# EasyEDA schematic SCH_PAYLOAD_2022-04-15.json
TITLE: Payload PCB; REV: 1.0; Date: 13-04-2022; Sheet: 1/1; Drawn By: Nipun Gupta; Company: Garuda
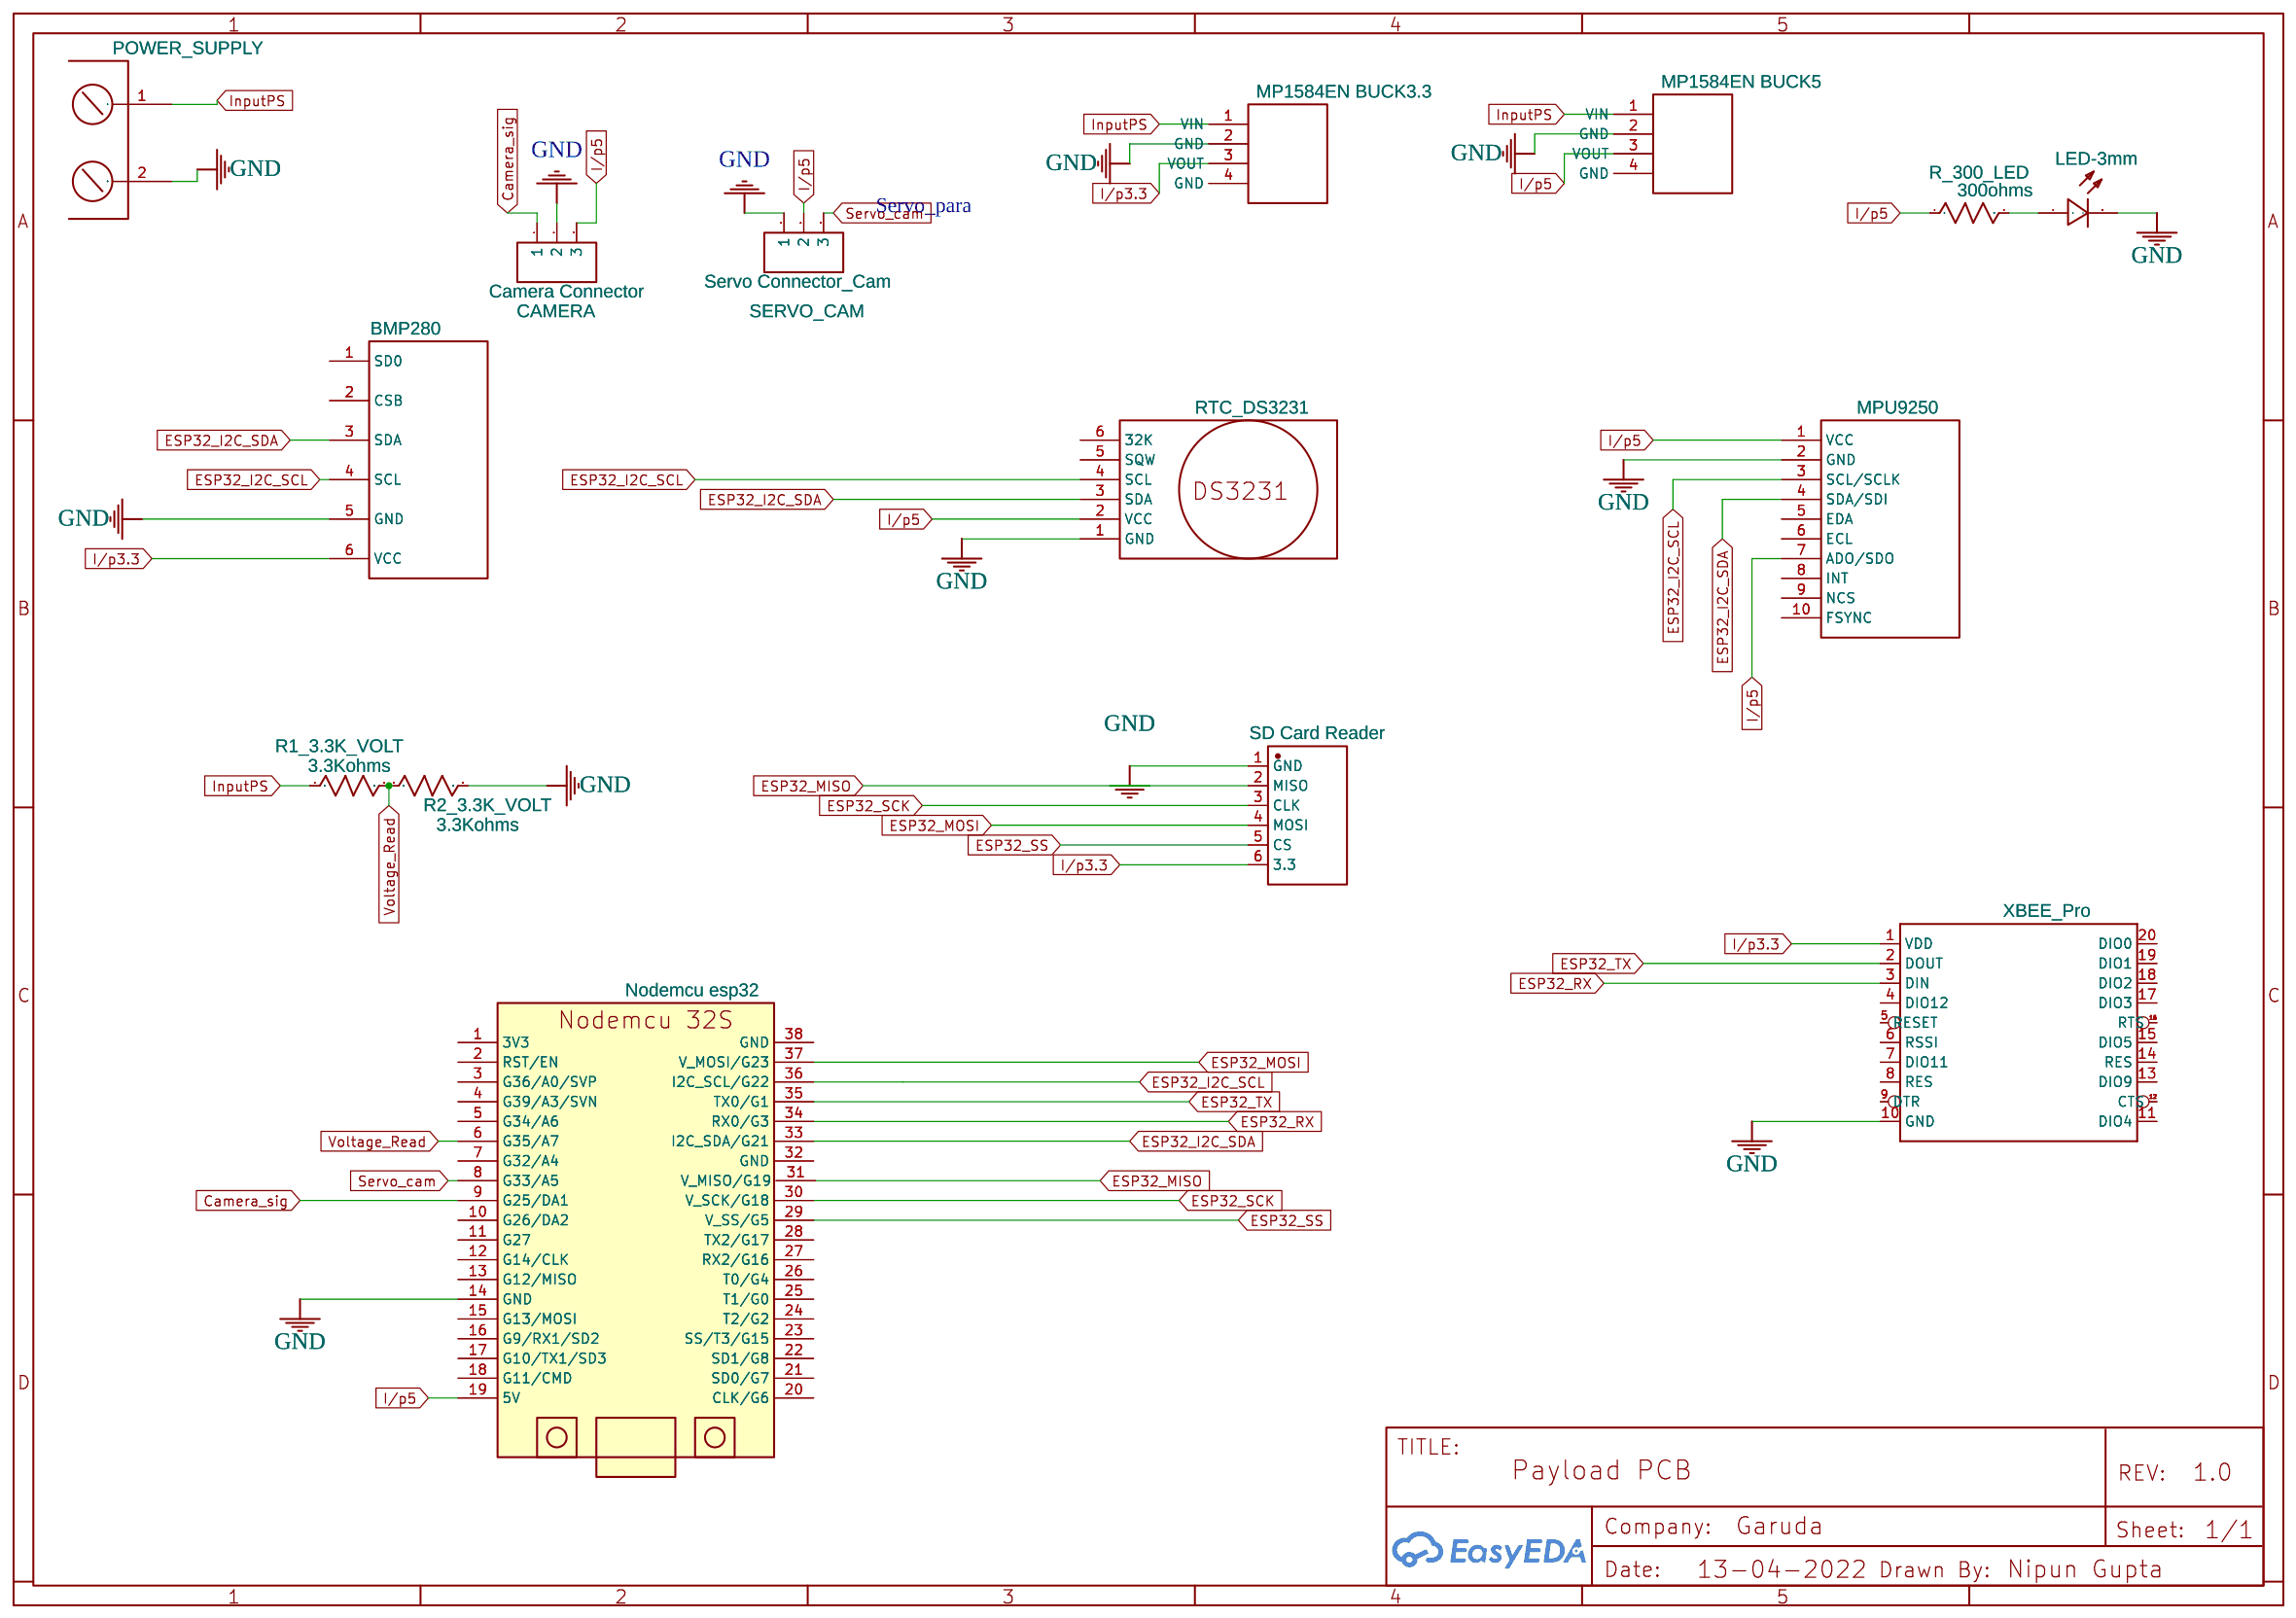
[diagram p0: schematic sheet]

## Parts
CAMERA  Camera Connector  [HDR-TH_3P-P2.54-V-F]
J1  POWER_SUPPLY  [5A_2PIN-TERMINALBLOCK]
JP2  XBEE_Pro  [XBEE-PRO-]
LED1  LED-3mm  [LED-3MM/2.54]
PRESS1  BMP280  [BMP 280 FOOT]
R1_3.3K_VOLT  3.3Kohms  [AXIAL-0.3]
R2_3.3K_VOLT  3.3Kohms  [AXIAL-0.3]
R_300_LED  300ohms  [AXIAL-0.3]
S1  MPU9250  [MPU9250_NOHOLE]
SD-READER3  SD Card Reader  [SD CARD READER FOOT]
SERVO_CAM  Servo Connector_Cam  [HDR-TH_3P-P2.54-V-F]
U2  MP1584EN BUCK5  [MP1584EN]
U3  MP1584EN BUCK3.3  [MP1584EN]
U9  RTC_DS3231  [DS3231]
U11  Nodemcu esp32  [NODEMCU-ESP32S]

## Library data of the parts
CAMERA SERVO_CAM = Header-Female-2.54_1x3: Supplier Part: C146243; Supplier: LCSC; Manufacturer: Boom Precision Elec; link: https://datasheet.lcsc.com/szlcsc/Boom-Precision-Elec-2-54mm-1-8P-Straight-Female-header_C27438.pdf; JLCPCB Part Class: Extended Part
J1 = 2pin_5A_TerminalBlock: Contributor: Obeng_smd
JP2 = XBEE_Pro: Digi XBee and XBee Pro; Contributor: Dev 91
LED1 = -: Supplier: LCSC; Manufacturer: EVERLIGHT; Manufacturer Part: 204-10SURD/S530-A3; Supplier Part: C99772
PRESS1 = BMP280 Sparkfun: Contributor: NIPUN GUPTA; sourceId: 6GASa4mDV; Manufacturer Part: ?
R1_3.3K_VOLT R2_3.3K_VOLT R_300_LED = Res_AXIAL-0.3(1/8W)_US: Manufacturer Part: ?; Package Display: No
S1 = MPU9250-MDL NO HOLES: TaoBao: GY-9250; Contributor: abyssvulcan; Supplier Part: GY-9250; Supplier: TaoBao
SD-READER3 = Micro SD Card Reader: Manufacturer Part: SD card reader 17.9x17.9; Contributor: Tinerfe; Supplier: AliExpress; Manufacturer: ShengYang; link: https://www.aliexpress.com/item/32867572635.html
U2 U3 = MP1584EN COPY: Contributor: babeinlovexd
U9 = UhrModul_DS3231: Contributor: Muffel
U11 = Nodemcu esp32: Contributor: SSanya

## Nets
GND: CAMERA.2 J1.2 JP2.10(GND) LED1.2(-) PRESS1.5(GND) R2_3.3K_VOLT.2 S1.2(GND) SD-READER3.1(GND) SERVO_CAM.1 U2.2(GND) U3.2(GND) U9.1(GND) U11.14(GND)
Camera_sig: CAMERA.1 U11.9(G25/DA1)
ESP32_I2C_SCL: PRESS1.4(SCL) S1.3(SCL/SCLK) U9.4(SCL) U11.36(I2C SCL/G22)
ESP32_I2C_SDA: PRESS1.3(SDA) S1.4(SDA/SDI) U9.3(SDA) U11.33(I2C SDA/G21)
ESP32_MISO: SD-READER3.2(MISO) U11.31(V_MISO/G19)
ESP32_MOSI: SD-READER3.4(MOSI) U11.37(V_MOSI/G23)
ESP32_RX: JP2.3(DIN) U11.34(RX0/G3)
ESP32_SCK: SD-READER3.3(CLK) U11.30(V_SCK/G18)
ESP32_SS: SD-READER3.5(CS) U11.29(V_SS/G5)
ESP32_TX: JP2.2(DOUT) U11.35(TX0/G1)
I/p3.3: JP2.1(VDD) PRESS1.6(VCC) SD-READER3.6(3.3) U3.3(VOUT)
I/p5: CAMERA.3 R_300_LED.1 S1.1(VCC) S1.7(ADO/SDO) SERVO_CAM.2 U2.3(VOUT) U9.2(VCC) U11.19(5V)
InputPS: J1.1 R1_3.3K_VOLT.1 U2.1(VIN) U3.1(VIN)
Servo_cam: SERVO_CAM.3 U11.8(G33/A5)
Voltage_Read: R1_3.3K_VOLT.2 R2_3.3K_VOLT.1 U11.6(G35/A7)
Net-(LED1-1): LED1.1(+) R_300_LED.2

Not connected (* = marked no-connect by the designer): JP2 4(DIO12) 5(RESET) 6(RSSI) 7(DIO11) 8(RES) 9(DTR) 11(DIO4) 12(CTS) 13(DIO9) 14(RES) 15(DIO5) 16(RTS) 17(DIO3) 18(DIO2) 19(DIO1) 20(DIO0); PRESS1 1(SD0) 2(CSB); S1 5(EDA) 6(ECL) 8(INT) 9(NCS) 10(FSYNC); U2 4(GND); U3 4(GND); U9 5(SQW) 6(32K); U11 1(3V3) 2(RST/EN) 3(G36/A0/SVP) 4(G39/A3/SVN) 5(G34/A6) 7(G32/A4) 10(G26/DA2) 11(G27) 12(G14/CLK) 13(G12/MISO) 15(G13/MOSI) 16(G9/RX1/SD2) 17(G10/TX1/SD3) 18(G11/CMD) 20(CLK/G6) 21(SD0/G7) 22(SD1/G8) 23(SS/T3/G15) 24(T2/G2) 25(T1/G0) 26(T0/G4) 27(RX2/G16) 28(TX2/G17) 32(GND) 38(GND)

## Notes on the sheet
- Servo_para
